# Altium project Wally_BMS.PrjPcb (part 3 of 3)

## Sheet Cell4_Balancing.SchDoc
size A; DocumentNumber: 7; SheetNumber: 7; SheetTotal: 7
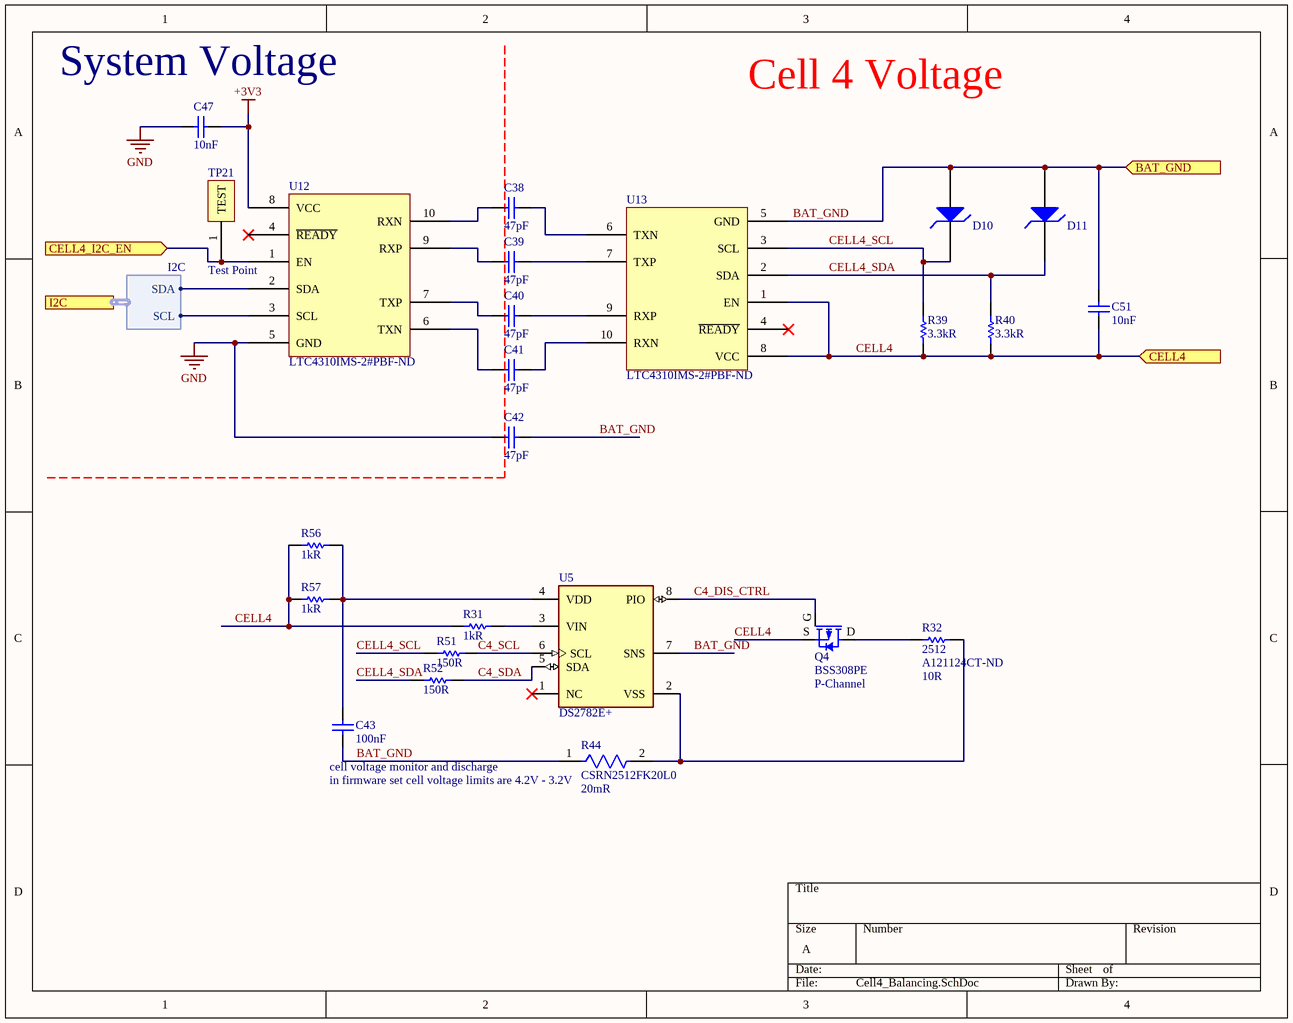
[diagram p6: Cell4_Balancing.SchDoc]

### Parts
C38  Capacitance: 47pF  [CAPC1608X90X35ML15T15]  (hidden comment: 06031A470FAT2A)
C39  Capacitance: 47pF  [CAPC1608X90X35ML15T15]  (hidden comment: 06031A470FAT2A)
C40  Capacitance: 47pF  [CAPC1608X90X35ML15T15]  (hidden comment: 06031A470FAT2A)
C41  Capacitance: 47pF  [CAPC1608X90X35ML15T15]  (hidden comment: 06031A470FAT2A)
C42  Capacitance: 47pF  [CAPC1608X90X35ML15T15]  (hidden comment: 06031A470FAT2A)
C43  Capacitance: 100nF  [C0402]  (hidden comment: Capacitor 0402)
C47  Capacitance: 10nF  [C0402]  (hidden comment: Capacitor 0402)
C51  Capacitance: 10nF  [C0402]  (hidden comment: Capacitor 0402)
D10  BZT52C4V7LP-7  [bzt52c4v7lp-7]  (value not drawn)
D11  BZT52C4V7LP-7  [bzt52c4v7lp-7]  (value not drawn)
Q4  BSS308PE  FET Type: P-Channel  [BSS308PE]
R31  Resistance: 1kR  [RES0402]  (hidden comment: Resistor 0402)
R32  Package / Case: 2512  Supplier Part Number 1: A121124CT-ND  Resistance: 10R  [RES2512]  (hidden comment: Resistor 2512)
R39  Resistance: 3.3kR  [RES0402]  (hidden comment: Resistor 0402)
R40  Resistance: 3.3kR  [RES0402]  (hidden comment: Resistor 0402)
R44  CSRN2512FK20L0  Resistance: 20mR  [FP-CSRN2512-IPC_C]
R51  Resistance: 150R  [RES0402]  (hidden comment: Resistor 0402)
R52  Resistance: 150R  [RES0402]  (hidden comment: Resistor 0402)
R56  Resistance: 1kR  [RES0402]  (hidden comment: Resistor 0402)
R57  Resistance: 1kR  [RES0402]  (hidden comment: Resistor 0402)
TP21  Test Point  [TEST POINT]
U5  DS2782E+  [FP-H8-2-MFG]
U12  LTC4310IMS-2#PBF-ND  [MSOP-10_MS_LIT]
U13  LTC4310IMS-2#PBF-ND  [MSOP-10_MS_LIT]

### Ports
BAT_GND (in), CELL4 (in), CELL4_I2C_EN (in), I2C (harness I2C)

### Harnesses
I2C: SCL, SDA

### Nets
+3V3: C47.1 U12.8(VCC)
GND: C42.1 C47.2 U12.5(GND)
BAT_GND: C42.2 C43.1 C51.1 D10.2(A) D11.2(A) R44.1 U5.7(SNS) U13.5(GND) ; port BAT_GND
C4_DIS_CTRL: Q4.G U5.8(PIO)
C4_SCL: R51.1 U5.6(SCL)
C4_SDA: R52.1 U5.5(SDA)
CELL4: C51.2 Q4.S R31.1 R39.1 R40.1 R56.1 R57.1 U13.1(EN) U13.8(VCC) ; port CELL4
CELL4_I2C_EN: TP21.1(TEST) U12.1(EN) ; port CELL4_I2C_EN
CELL4_SCL: D10.1(K) R39.2 R51.2 U13.3(SCL)
CELL4_SDA: D11.1(K) R40.2 R52.2 U13.2(SDA)
SCL: U12.3(SCL) ; port I2C.SCL
SDA: U12.2(SDA) ; port I2C.SDA
NetC38_1: C38.1 U12.10(RXN)
NetC38_2: C38.2 U13.6(TXN)
NetC39_1: C39.1 U12.9(RXP)
NetC39_2: C39.2 U13.7(TXP)
NetC40_1: C40.1 U12.7(TXP)
NetC40_2: C40.2 U13.9(RXP)
NetC41_1: C41.1 U12.6(TXN)
NetC41_2: C41.2 U13.10(RXN)
NetC43_2: C43.2 R56.2 R57.2 U5.4(VDD)
NetQ4_D: Q4.D R32.1
NetR31_2: R31.2 U5.3(VIN)
NetR32_2: R32.2 R44.2 U5.2(VSS)

Not connected (* = marked no-connect by the designer): U5 1(NC)*; U12 4(~{READY})*; U13 4(~{READY})*

### Notes on the sheet
- (near C47) System Voltage
- Cell 4 Voltage
- (near C43) cell voltage monitor and discharge
- (near R44) in firmware set cell voltage limits are 4.2V - 3.2V

### Library data of the parts
C38-C42 = CMP-2006-04042-1: Manufacturer: AVX Interconnect / Elco; Voltage Rating: 100V; Part Number: 06031A470FAT2A
C43 = Capacitor 0402: CAP CER 0.1UF 25V X5R 0402 / High Value Multilayer Ceramic Capacitors (High dielectric type); Manufacturer: Taiyo Yuden; Manufacturer Part Number: TMK105BJ104KV-F; Tolerance: 10%; Package / Case: 0402; Supplier 1: Digi-Key; Supplier Part Number 1: 587-1456-1-ND; RoHS: Yes; Category: Ceramic Capacitors; Stock 1: 2308231; Pricing 1: 1=0.10000, 10=0.04200, 50=0.02280, 100=0.01860, 500=0.01328, 1000=0.01044, 2500=0.00949, 5000=0.00873 (USD); Mount: Surface Mount; Case/Package: 0402; Number of Pins: 2; Case Code (Imperial): 0402; Case Code (Metric): 1005; Weight: 2.3E-05oz; Min Operating Temperature: -55°C; Max Operating Temperature: 85°C; Packaging: Tape and Reel; Dielectric: X5R; Voltage Rating (DC): 25V; Voltage Rating: 25V; Package Quantity: 1; Termination: SMD/SMT; Resistor Type: Ceramic; Voltage: 25V; Series: M; Construction: Flat; Length: 1mm; Width: 0.5mm; Height: 0.5mm; Depth: 0.5mm; Thickness: 0.022inch; REACH SVHC: No SVHC; Lead Free: Lead Free; Halogen Free: Halogen Free; RoHS Compliant: Yes; ComponentLink1URL: https://datasheet.ciiva.com/131/tmk105bj104kv-f-ss-131420.pdf?src-supplier=Digi-Key; ComponentLink1Description: https://datasheet.ciiva.com/131/tmk105bj104kv-f-ss-131420.pdf?src-supplier=Digi-Key; ComponentLink2URL: https://datasheet.ciiva.com/15922/28tmk105bj104kv-f-15922315.pdf?src-supplier=Onlinecomponents.com; ComponentLink2Description: https://datasheet.ciiva.com/15922/28tmk105bj104kv-f-15922315.pdf?src-supplier=Onlinecomponents.com; ComponentLink3URL: https://datasheet.ciiva.com/30051/25tmk105bj104kv-f-30051094.pdf?src-supplier=Onlinecomponents.com; ComponentLink3Description: https://datasheet.ciiva.com/30051/25tmk105bj104kv-f-30051094.pdf?src-supplier=Onlinecomponents.com; ComponentLink4URL: https://datasheet.ciiva.com/22768/1693457-22768649.pdf?src-supplier=Farnell; ComponentLink4Description: https://datasheet.ciiva.com/22768/1693457-22768649.pdf?src-supplier=Farnell
C47 C51 = Capacitor 0402: Cap Ceramic 0.01uF 25V X7R 10% Pad SMD 0402 125C T/R; Manufacturer: Samsung; Manufacturer Part Number: CL05B103KA5NNNC; Package / Case: 0402; Supplier 1: Digi-Key; Supplier Part Number 1: 1276-1057-2-ND; RoHS: Yes; Category: Ceramic Capacitors; Stock 1: 889741; Pricing 1: 10000=0.00314, 20000=0.00299 (USD); Mount: Surface Mount; Case/Package: 0402; Case Code (Metric): 1005; Case Code (Imperial): 0402; Contact Plating: Tin; Min Operating Temperature: -55°C; Max Operating Temperature: 125°C; Tolerance: 10%; Dielectric: X7R; Packaging: Tape and Reel; Package Quantity: 1; Voltage Rating: 25V; Series: CL; Construction: Flat; Length: 1mm; Width: 0.02inch; Height: 0.5mm; Thickness: 0.022inch; Depth: 0.5mm; Radiation Hardening: No; RoHS Compliant: Yes; ComponentLink1URL: https://datasheet.ciiva.com/15195/getdatasheetpartid-358612-15195635.pdf?src-supplier=Verical; ComponentLink1Description: https://datasheet.ciiva.com/15195/getdatasheetpartid-358612-15195635.pdf?src-supplier=Verical; ComponentLink2URL: https://datasheet.ciiva.com/16740/cl05b104kq5nnnc-16740683.pdf?src-supplier=Future+Electronics; ComponentLink2Description: https://datasheet.ciiva.com/16740/cl05b104kq5nnnc-16740683.pdf?src-supplier=Future+Electronics
D10 D11 = BZT52C4V7LP-7: BZT52C4V7LP Series 4.7 V 10 mA Surface Mount Zener Diode - DFN1006-2; Manufacturer: Diodes; Max Power Dissipation: 250mW; Max Reverse Leakage Current: 3uA; Zener Voltage: 4.7V; Element Configuration: Single; Tolerance: 6%; Impedance: 80R; Voltage Tolerance: 6.38%; Test Current: 5mA; Forward Voltage: 900mV; ESD Protection: No; Supplier 1: Digi-Key; Supplier Part Number 1: BZT52C4V7LPDICT-ND; Manufacturer Part Number: BZT52C4V7LP-7; RoHS: Yes; Category: Zener Diodes; Stock 1: 13216; Pricing 1: 1=0.50000, 10=0.37000, 100=0.20930, 500=0.13860, 1000=0.10626 (USD); Mount: Surface Mount; Case/Package: DFN; Number of Pins: 2; Weight: 3.5E-05oz; Contact Plating: Gold; Min Operating Temperature: -65°C; Max Operating Temperature: 150°C; Packaging: Tape and Reel; Package Quantity: 3000; Power Dissipation: 250mW; Termination: SMD/SMT; Zener Current: 3uA; Max Reverse Current: 3uA; Power Rating: 250mW; Series: -; Length: 1mm; Width: 0.6mm; Height: 0.5mm; REACH SVHC: No SVHC; Lead Free: Lead Free; RoHS Compliant: Yes; ComponentLink1URL: https://datasheet.ciiva.com/4734/ds30506-89295-4734027.pdf?src-supplier=Mouser; ComponentLink1Description: https://datasheet.ciiva.com/4734/ds30506-89295-4734027.pdf?src-supplier=Mouser; ComponentLink2URL: https://datasheet.ciiva.com/10639/ds30506-10639820.pdf?src-supplier=Avnet; ComponentLink2Description: https://datasheet.ciiva.com/10639/ds30506-10639820.pdf?src-supplier=Avnet
Q4 = BSS308PE: MOSFET P-CH 30V 2A SOT23; Current - Continuous Drain (Id) @ 25°C: 2A (Ta); Drive Voltage (Max Rds On, Min Rds On): 4.5V, 10V; Vgs(th) (Max) @ Id: 2V @ 11µA; Gate Charge (Qg) (Max) @ Vgs: 5nC @ 10V; Input Capacitance (Ciss) (Max) @ Vds: 500pF @ 15V; Vgs (Max): ±20V; Power Dissipation (Max): 500mW (Ta); Rds On (Max) @ Id, Vgs: 80 mOhm @ 2A, 10V; Supplier 1: Digi-Key; Supplier Part Number 1: BSS308PEH6327XTSA1CT-ND; Technology: MOSFET; Drain to Source Voltage (Vdss): 30V; Operating Temperature: -55°C ~ 150°C (TJ); Supplier Device Package: PG-SOT23-3
R31 R56 R57 = Resistor 0402: Res Thick Film 0402 1K Ohm 1% 0.063W(1/16W) ±100ppm/C Pad SMD Automotive T/R; Manufacturer: Stackpole Electronics; Manufacturer Part Number: RMCF0402FT1K00; Power Rating: 63mW; Temperature Coefficient: 100ppm/°C; Package / Case: 0402; Supplier 1: Digi-Key; Supplier Part Number 1: RMCF0402FT1K00CT-ND; RoHS: Yes; Category: Chip SMD Resistors; Stock 1: 10972117; Pricing 1: 1=0.10000, 10=0.01500, 100=0.00610, 1000=0.00274, 2500=0.00238, 5000=0.00197 (USD); Mount: Surface Mount; Case/Package: 0402; Case Code (Metric): 1005; Case Code (Imperial): 0402; Contact Plating: Tin,Matte; Size Code: 0402; Min Operating Temperature: -55°C; Max Operating Temperature: 155°C; Tolerance: 1%; Packaging: Tape and Reel; Resistor Type: Thick Film; Number of Terminations: 2; Max Power Dissipation: 63mW; Features: Automotive AEC-Q200; Series: RMCF; Construction: Rectangular; Length: 1mm; Width: 0.02inch; Height: 0.016inch; Depth: 0.5mm; Radiation Hardening: No; Military Standard: Not; Lead Free: Lead Free; RoHS Compliant: Yes; ComponentLink1URL: https://datasheet.ciiva.com/24336/sei-rmcp-24336266.pdf?src-supplier=Onlinecomponents.com; ComponentLink1Description: https://datasheet.ciiva.com/24336/sei-rmcp-24336266.pdf?src-supplier=Onlinecomponents.com; ComponentLink2URL: https://datasheet.ciiva.com/15193/getdatasheetpartid-365385-15193418.pdf?src-supplier=Verical; ComponentLink2Description: https://datasheet.ciiva.com/15193/getdatasheetpartid-365385-15193418.pdf?src-supplier=Verical
R32 = Resistor 2512: CGS - TE CONNECTIVITY - 352210RJT - SMD Chip Resistor, 2512 [6432 Metric], 10 ohm, 3522 Series, 250 V, Thick Film, 3 W; Manufacturer: TE Connectivity CGS; Manufacturer Part Number: 1-2176230-4; Power Rating: 3W; Voltage Rating: 250V; Tolerance: 5%; Number of Resistors: 1; Temperature Coefficient: 200ppm/°C; Supplier 1: Digi-Key; RoHS: Yes; Category: Chip SMD Resistors; Stock 1: 3022; Pricing 1: 1=0.74000, 10=0.62000, 100=0.41620, 1000=0.24350 (USD); Mount: Surface Mount; Case/Package: 2512; Case Code (Metric): 6432; Case Code (Imperial): 2512; Min Operating Temperature: -55°C; Max Operating Temperature: 105°C; Termination: Solder; Packaging: Tape and Reel; Resistor Type: Thick Film,Power resistor; Voltage Rating (DC): 250V; Number of Terminations: 2; Length: 6.35mm; Height: 1.1mm; Depth: 3.2mm; RoHS Compliant: Yes; REACH SVHC: Unknown; ComponentLink1URL: http://www.farnell.com/datasheets/2007092.pdf?src-supplier=Farnell; ComponentLink1Description: http://www.farnell.com/datasheets/2007092.pdf?src-supplier=Farnell; ComponentLink2URL: http://uk.rs-online.com/webdocs/142d/0900766b8142d0f1.pdf?src-supplier=RSComponents; ComponentLink2Description: http://uk.rs-online.com/webdocs/142d/0900766b8142d0f1.pdf?src-supplier=RSComponents; ComponentLink3URL: http://www.te.com/commerce/DocumentDelivery/DDEController?Action=srchrtrv&DocNm=9-1773463-7&DocType=DS&DocLang=English&src-supplier=Digi-Key; ComponentLink3Description: http://www.te.com/commerce/DocumentDelivery/DDEController?Action=srchrtrv&DocNm=9-1773463-7&DocType=DS&DocLang=English&src-supplier=Digi-Key; ComponentLink4URL: https://www.te.com/commerce/DocumentDelivery/DDEController?Action=srchrtrv&DocNm=9-1773463-7&DocType=DS&DocLang=English&src-supplier=Digi-Key; ComponentLink4Description: https://www.te.com/commerce/DocumentDelivery/DDEController?Action=srchrtrv&DocNm=9-1773463-7&DocType=DS&DocLang=English&src-supplier=Digi-Key; ComponentLink5URL: http://www.farnell.com/datasheets/2007092.pdf?src-supplier=Element14; ComponentLink5Description: http://www.farnell.com/datasheets/2007092.pdf?src-supplier=Element14; ComponentLink6URL: http://www.farnell.com/datasheets/2007092.pdf?src-supplier=Newark; ComponentLink6Description: http://www.farnell.com/datasheets/2007092.pdf?src-supplier=Newark
R39 R40 = Resistor 0402: Res Thin Film 0402 3.3K Ohm 1% 1/16W ±50ppm/°C Molded SMD SMD Paper T/R; Manufacturer: Yageo; Manufacturer Part Number: RT0402FRE073K3L; Power Rating: 62.5mW; Voltage Rating: 50V; Max Power Dissipation: 63mW; Package / Case: 0402; Supplier 1: Digi-Key; Supplier Part Number 1: 13-RT0402FRE073K3LCT-ND; RoHS: Yes; Category: Chip SMD Resistors; Stock 1: 19890; Pricing 1: 1=0.10000, 10=0.07300, 100=0.02970, 1000=0.01336, 2500=0.01159, 5000=0.00958 (USD); Case/Package: 0402; Contact Plating: Tin,Matte; Case Code (Imperial): 0402; Case Code (Metric): 1005; Weight: 2.3E-05oz; Min Operating Temperature: -55°C; Max Operating Temperature: 125°C; Tolerance: 1%; Resistor Type: Thin Film; Temperature Coefficient: 50ppm/°C; Packaging: Tape and Reel; Termination: SMD/SMT; Voltage Rating (DC): 50V; Series: RT; Number of Terminations: 2; Construction: Rectangular; Length: 1mm; Width: 0.5mm; Height: 0.3mm; Depth: 0.5mm; Radiation Hardening: No; Military Standard: Not; Lead Free: Lead Free; RoHS Compliant: Yes; ComponentLink1URL: https://datasheet.ciiva.com/8893/pyu-rt-1-to-0-05-rohs-l-4-8893834.pdf?src-supplier=Avnet; ComponentLink1Description: https://datasheet.ciiva.com/8893/pyu-rt-1-to-0-05-rohs-l-4-8893834.pdf?src-supplier=Avnet; ComponentLink2URL: https://datasheet.ciiva.com/12810/pyu-rt-1-to-0-05-rohs-l-4-12810011.pdf?src-supplier=Mouser; ComponentLink2Description: https://datasheet.ciiva.com/12810/pyu-rt-1-to-0-05-rohs-l-4-12810011.pdf?src-supplier=Mouser
R44 = CMP-26527-002510-1: Res Thick Film 2512 20mΩ 1% 2W ±200ppm/°C Molded SMD Plastic T/R; Case/Package: 2512; Case Code (Metric): 6432; Length: 0.25inch; Temperature Coefficient: 200ppm/°C; Width: 0.124inch; Min Operating Temperature: -55°C; Packaging: Tape and Reel; Max Operating Temperature: 155°C; Height: 0.028inch; Number of Terminations: 2; Contact Plating: Tin; Max Power Dissipation: 2W; Case Code (Imperial): 2512; Resistor Type: Thick Film; Depth: 3.15mm; RoHS Compliant: Yes; Series: CSRN; Size Code: 2512; Military Standard: Not; Lead Free: Lead Free; Tolerance: 1%; Power Rating: 2W; Mount: Surface Mount; Radiation Hardening: No; Construction: Rectangular
R51 R52 = Resistor 0402: Res Thin Film 0402 150 Ohm 1% 1/16W ±50ppm/°C Molded SMD SMD Paper T/R; Manufacturer: Yageo; Manufacturer Part Number: RT0402FRE07150RL; Voltage Rating (DC): 50V; Max Power Dissipation: 63mW; Package / Case: 0402; Supplier 1: Digi-Key; Supplier Part Number 1: 13-RT0402FRE07150RLCT-ND; RoHS: Yes; Category: Chip SMD Resistors; Stock 1: 4336; Pricing 1: 1=0.10000, 10=0.07300, 100=0.02970, 1000=0.01336, 2500=0.01159, 5000=0.00958 (USD); Case/Package: 0402; Contact Plating: Tin,Matte; Min Operating Temperature: -55°C; Max Operating Temperature: 125°C; Tolerance: 1%; Resistor Type: Thin Film; Temperature Coefficient: 50ppm/°C; Packaging: Tape and Reel; Series: RT; Number of Terminations: 2; Construction: Rectangular; Length: 1mm; Width: 500um; Depth: 0.5mm; Radiation Hardening: No; Military Standard: Not; Lead Free: Lead Free; RoHS Compliant: Yes; ComponentLink1URL: http://components.arrow.com/part/dataview/0323_03313190?src-supplier=Arrow+Europe; ComponentLink1Description: http://components.arrow.com/part/dataview/0323_03313190?src-supplier=Arrow+Europe; ComponentLink2URL: http://www.yageo.com/documents/recent/PYu-RT_1-to-0.05_RoHS_L_6.pdf?src-supplier=Avnet; ComponentLink2Description: http://www.yageo.com/documents/recent/PYu-RT_1-to-0.05_RoHS_L_6.pdf?src-supplier=Avnet; ComponentLink3URL: http://www.yageo.com/documents/recent/PYu-RT_1-to-0.01_RoHS_L_10.pdf?src-supplier=Digi-Key; ComponentLink3Description: http://www.yageo.com/documents/recent/PYu-RT_1-to-0.01_RoHS_L_10.pdf?src-supplier=Digi-Key; ComponentLink4URL: http://www.yageo.com/documents/recent/PYu-RT_1-to-0.05_RoHS_L_(4).pdf?src-supplier=Avnet+Europe; ComponentLink4Description: http://www.yageo.com/documents/recent/PYu-RT_1-to-0.05_RoHS_L_(4).pdf?src-supplier=Avnet+Europe
U5 = CMP-05715-000007-1: IC FUEL GAUGE BATT 8TSSOP; Manufacturer: Maxim; Number Of Cells: 2; Standoff Height: 0.05mm; Nominal Supply Current: 65uA; Max Supply Voltage: 5.5V; Min Supply Voltage: 2.5V; Height: 1.1mm; Octopart: https://octopart.com/ds2782e%2B-maxim+integrated-8045252; Lead Free: Yes; Temperature: -40°C to +85°C; ComponentLink2Description: Datasheet; Temperature Range High: +85°C; Package: H8-2; RoHS: TRUE; ComponentLink2URL: https://datasheets.maximintegrated.com/en/ds/DS2782.pdf; Category: IC; Mouser Description: Battery Fuel Gauge, Li-ion/nimhl, TSSOP8; Device Class L1: Integrated Circuits (ICs); Manufacturer Part Number: DS2782E+; Automotive: No; Device Class L3: Battery Management; Temperature Range Low: -40°C; Digikey Description: IC FUEL GAUGE BATT 8TSSOP; Device Class L2: Power Management ICs; Footprint Url: https://pdfserv.maximintegrated.com/land_patterns/90-0248.PDF
U12 U13 = LTC4310IMS-2#PBF: DIGITAL ISOLATOR 2CH I2C 10MSOP

## Sheet PG_N_Indicator.SchDoc
size A
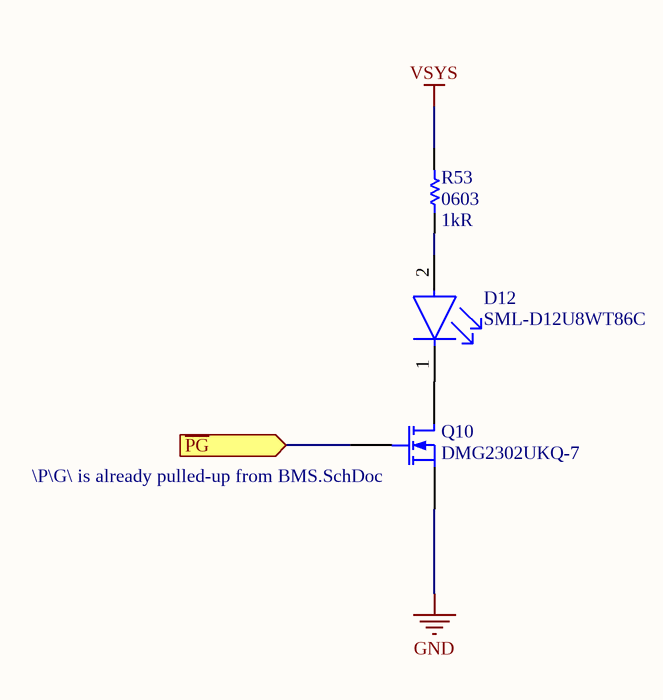
[diagram p7: PG_N_Indicator.SchDoc]

### Parts
D12  SML-D12U8WT86C  [FP-SML-D12-MFG]
Q10  Manufacturer Part Number: DMG2302UKQ-7  [*SOT23]
R53  Package / Case: 0603  Resistance: 1kR  [RES0603]  (hidden comment: Resistor 0603)

### Ports
~{PG} (in)

### Nets
GND: Q10.2(S)
VSYS: R53.2
~{PG}: Q10.1(G) ; port ~{PG}
NetD12_1: D12.1(C) Q10.3(D)
NetD12_2: D12.2(A) R53.1

### Notes on the sheet
- (near Q10) \P\G\ is already pulled-up from BMS.SchDoc

### Library data of the parts
D12 = CMP-08952-000014-1: LED RED 1608 SMD; Manufacturer: Rohm; Reverse Voltage: 5V; Wavelength: 620nm; Luminous Intensity: 63mcd; Automotive Grade: Grade 3; Forward Voltage: 2.2V; Led Orientation: Top View; Forward Current: 20mA; Power Dissipation: 54mW; Mouser Description: LED Uni-Color Red Automotive 2-Pin Chip 0603(1608Metric) T/R; Colour: Red; ComponentLink2Description: Datasheet; Category: Diode; Package: SML-D12; RoHS: TRUE; Temperature Range Low: -40°C; Lead Free: Yes; Height: 0.65mm; Manufacturer Part Number: SML-D12U8WT86C; Digikey Description: LED RED 1608 SMD; Octopart: https://octopart.com/sml-d12u8wt86c-rohm-77740214; Device Class L3: unset; Temperature Range High: +85°C; Device Class L1: Optoelectronics; ComponentLink2URL: https://fscdn.rohm.com/en/products/databook/datasheet/opto/led/chip_mono/sml-d12x8(c)-e.pdf; Device Class L2: LEDs; Temperature: -40°C to +85°C; Automotive: Yes
Q10 = DMG2302UK-7: Mosfet, N-ch, 20V, 2.8A, SOT-23 Rohs Compliant: Yes; Manufacturer: Diodes; Rds On Max: 90mR; Input Capacitance: 130pF; Max Power Dissipation: 660mW; Supplier 1: Digi-Key; Supplier Part Number 1: 31-DMG2302UKQ-7CT-ND; RoHS: Yes; Stock 1: 126285; Pricing 1: 1=0.48000, 10=0.36000, 100=0.22400, 500=0.15330, 1000=0.11792 (USD); Mount: Surface Mount; Case/Package: SOT-23; Min Operating Temperature: -55°C; Max Operating Temperature: 150°C; Packaging: Tape and Reel; Drain to Source Voltage (Vdss): 20V; Continuous Drain Current (ID): 2.8A
R53 = Resistor 0603: Res Thick Film 0603 1K Ohm 1% 0.25W(1/4W) ±100ppm/°C Epoxy Resin Pad SMD Automotive T/R; Manufacturer: Rohm; Manufacturer Part Number: ESR03EZPF1001; Power Rating: 250mW; Supplier 1: Digi-Key; Supplier Part Number 1: RHM1.00KADCT-ND; RoHS: Yes; Category: Chip SMD Resistors; Stock 1: 429236; Pricing 1: 1=0.13000, 10=0.12000, 100=0.04600, 1000=0.02024, 2500=0.01748 (USD); Case/Package: 0603; Case Code (Metric): 1608; Case Code (Imperial): 0603; Size Code: 0603; Min Operating Temperature: -55°C; Max Operating Temperature: 155°C; Package Quantity: 1; Tolerance: 1%; Packaging: Tape and Reel; Resistor Type: Thick Film; Number of Terminations: 2; Temperature Coefficient: 100ppm/°C; Max Power Dissipation: 250mW; Features: Automotive AEC-Q200; Series: ESR; Length: 0.063inch; Width: 0.031inch; Height: 0.022inch; Lead Free: Lead Free; RoHS Compliant: Yes; ComponentLink1URL: https://datasheet.ciiva.com/2469/esr-2469712.pdf?src-supplier=Digi-Key; ComponentLink1Description: https://datasheet.ciiva.com/2469/esr-2469712.pdf?src-supplier=Digi-Key; ComponentLink2URL: https://datasheet.ciiva.com/2469/esr-2469713.pdf?src-supplier=Digi-Key; ComponentLink2Description: https://datasheet.ciiva.com/2469/esr-2469713.pdf?src-supplier=Digi-Key; ComponentLink3URL: https://datasheet.ciiva.com/2469/esr-2469714.pdf?src-supplier=Digi-Key; ComponentLink3Description: https://datasheet.ciiva.com/2469/esr-2469714.pdf?src-supplier=Digi-Key

## Nets that join several sheets
+3V3: BMS (5 pins), Connectors (J1.16 TP12.1), Cell1_Balancing (C44.1 U6.8), Cell2_Balancing (C45.1 U8.8), Cell3_Balancing (C46.1 U10.8), Cell4_Balancing (C47.1 U12.8)
GND: BMS (30 pins), Connectors (13 pins), Cell1_Balancing (C24.1 C44.2 U6.5), Cell2_Balancing (C30.1 C45.2 U8.5), Cell3_Balancing (C36.1 C46.2 U10.5), Cell4_Balancing (C42.1 C47.2 U12.5), PG_N_Indicator (Q10.2)
Pre-VSYS: BMS (11 pins), Connectors (R4.2)
VBAT: BMS (7 pins), Connectors (R17.2)
VBUS: BMS (8 pins), Connectors (C19.2 R18.2 R19.1)
VSYS: Connectors (6 pins), PG_N_Indicator (R53.2)
~{CE}: BMS (R14.2 TP7.1 U1.G4), Connectors (J1.8)
~{INT}: BMS (R11.2 U1.G5), Connectors (J1.13)
~{PG}: BMS (R9.2 U1.H3), PG_N_Indicator (Q10.1)
~{QON}: BMS (U1.G3), Connectors (J1.14)
BAT_GND: Connectors (F6.2), Cell4_Balancing (8 pins)
CELL1: Connectors (F2.2), Cell1_Balancing (9 pins)
CELL1_I2C_EN: Connectors (J1.2), Cell1_Balancing (TP18.1 U6.1)
CELL2: Connectors (F3.2), Cell1_Balancing (8 pins), Cell2_Balancing (9 pins)
CELL2_I2C_EN: Connectors (J1.1), Cell2_Balancing (TP19.1 U8.1)
CELL3: Connectors (F4.2), Cell2_Balancing (8 pins), Cell3_Balancing (9 pins)
CELL3_I2C_EN: Connectors (J1.3), Cell3_Balancing (TP20.1 U10.1)
CELL4: Connectors (F5.2), Cell3_Balancing (8 pins), Cell4_Balancing (9 pins)
CELL4_I2C_EN: Connectors (J1.4), Cell4_Balancing (TP21.1 U12.1)
IBAT: BMS (R12.1 TP5.1 U1.H6), Connectors (J1.23)
SCL: BMS (R15.2 U1.H4), Connectors (D1.5 J1.6), Cell1_Balancing (U6.3), Cell2_Balancing (U8.3), Cell3_Balancing (U10.3), Cell4_Balancing (U12.3)
SDA: BMS (R16.2 U1.H5), Connectors (D1.4 J1.7), Cell1_Balancing (U6.2), Cell2_Balancing (U8.2), Cell3_Balancing (U10.2), Cell4_Balancing (U12.2)
STAT: BMS (R13.2 U1.F1), Connectors (J1.12)